# Altium project LEDcontroller_V0.PrjPcb
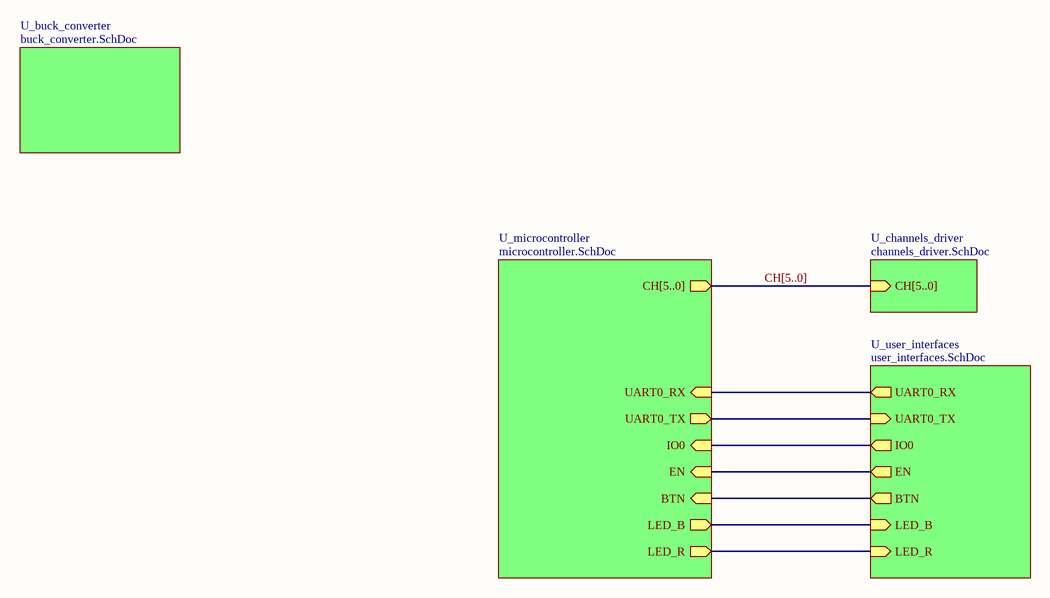
[diagram p0: LEDcontroller.SchDoc]
5 sheets, 40 parts. Net scope: hierarchical (ports join the sheet entries above them; power ports are global).
Board file: LEDcontroller.PcbDoc
Sheets:
  LEDcontroller.SchDoc
    U_buck_converter = buck_converter.SchDoc
    U_microcontroller = microcontroller.SchDoc
    U_channels_driver = channels_driver.SchDoc
    U_user_interfaces = user_interfaces.SchDoc

## Sheet LEDcontroller.SchDoc
size A4; SheetNumber: 1; SheetTotal: 5

### Sub-sheets
U_buck_converter = buck_converter.SchDoc: no entries
U_channels_driver = channels_driver.SchDoc: CH[5..0] (in)
U_microcontroller = microcontroller.SchDoc: CH[5..0] (out), UART0_TX (out), UART0_RX (in), IO0 (in), BTN (in), LED_R (out), LED_B (out), EN (in)
U_user_interfaces = user_interfaces.SchDoc: UART0_TX (in), UART0_RX (out), IO0 (out), EN (out), BTN (out), LED_R (in), LED_B (in)

### Nets
EN: sheet U_microcontroller/EN, sheet U_user_interfaces/EN
IO0: sheet U_microcontroller/IO0, sheet U_user_interfaces/IO0
RX: sheet U_microcontroller/UART0_RX, sheet U_user_interfaces/UART0_RX
TX: sheet U_microcontroller/UART0_TX, sheet U_user_interfaces/UART0_TX
NetD1_1: sheet U_microcontroller/BTN, sheet U_user_interfaces/BTN
NetR11_1: sheet U_microcontroller/LED_B, sheet U_user_interfaces/LED_B
NetR12_1: sheet U_microcontroller/LED_R, sheet U_user_interfaces/LED_R

### Buses and harness runs
bus CH[5..0] = sheet U_channels_driver/CH[5..0] = sheet U_microcontroller/CH[5..0]

## Sheet buck_converter.SchDoc
size A4; SheetNumber: 2; SheetTotal: 5
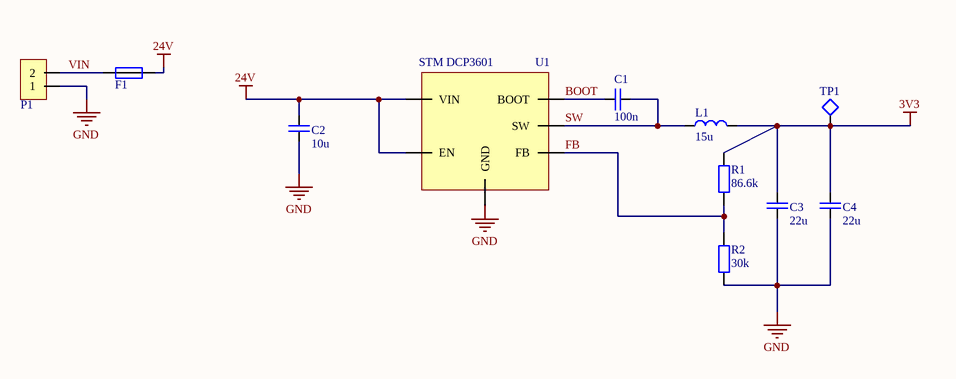
[diagram p1: buck_converter.SchDoc]

### Parts
C1  100n  [capacitor_smd_0603]
C2  10u  [capacitor_smd_1206]
C3  22u  [capacitor_smd_0805]
C4  22u  [capacitor_smd_0805]
F1  Fuse  [resisitor_smd_0603]  (value not drawn)
L1  15u  [inductor_smd_5mm8_x_5mm8]
P1  Terminal Block  [terminal_block_1X2_5mm08]  (value not drawn)
R1  86.6k  [resisitor_smd_0603]
R2  30k  [resisitor_smd_0603]
TP1  Test point  [test_point]  (value not drawn)
U1  STM DCP3601  [generic_sot23-6L]

### Nets
3V3: C3.1 C4.1 L1.2 R1.2 TP1.1
24V: C2.2 F1.1 U1.4(EN) U1.5(VIN)
GND: C2.1 C3.2 C4.2 P1.1 R2.2 U1.2(GND)
BOOT: C1.2 U1.1(BOOT)
FB: R1.1 R2.1 U1.3(FB)
SW: C1.1 L1.1 U1.6(SW)
VIN: F1.2 P1.2

### Library data of the parts
C1 = Capacitor - non-polarised: Vishay GA0603Y104KXAAC31G
C2 = Capacitor - non-polarised: Samsung CL31B106KBHNNNE
C3 C4 = Capacitor - non-polarised: TDK C2012X5R1V226M125AC
F1 = Fuse: Bourns SF-0603HI800M-2
L1 = Inductor: Bourns SRR5828A-150M
P1 = Terminal Block 1X2: Adam Tech EBAFA-02-D
R1 = Resistor: Panasonic ERA-3AEB8662V
R2 = Resistor: Panasonic ERA-3APB303V
U1 = STM DCP3601: STM DCP3601NDMR

## Sheet microcontroller.SchDoc
size A4; SheetNumber: 3; SheetTotal: 5
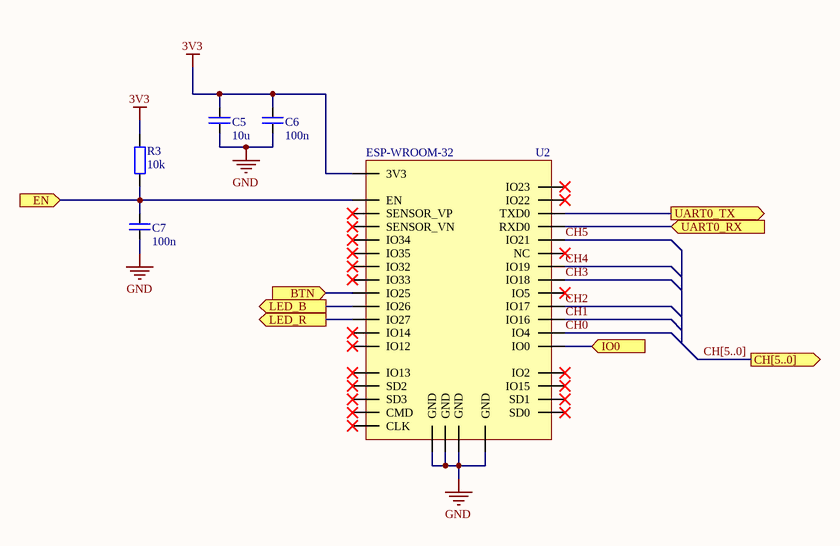
[diagram p2: microcontroller.SchDoc]

### Parts
C5  10u  [capacitor_smd_0805]
C6  100n  [capacitor_smd_0603]
C7  100n  [capacitor_smd_0603]
R3  10k  [resisitor_smd_0603]
U2  ESP-WROOM-32  [ESP-WROOM-32_no_silk]

### Ports
BTN (in, see LEDcontroller[3C], user_interfaces[4C]), CH[5..0] (out, see LEDcontroller[3B], channels_driver[1A]), EN (in, see LEDcontroller[3C], user_interfaces[1A]), IO0 (in, see LEDcontroller[3C], user_interfaces[1A]), LED_B (out, see LEDcontroller[3C], user_interfaces[2C]), LED_R (out, see LEDcontroller[3C], user_interfaces[2C]), UART0_RX (in, see LEDcontroller[3B], user_interfaces[1A]), UART0_TX (out, see LEDcontroller[3B], user_interfaces[1A])

### Nets
3V3: C5.1 C6.1 R3.1 U2.2(3V3)
GND: C5.2 C6.2 C7.2 U2.1(GND) U2.15(GND) U2.38(GND) U2.39(GND)
CH0: U2.26(IO4)
CH1: U2.27(IO16)
CH2: U2.28(IO17)
CH3: U2.30(IO18)
CH4: U2.31(IO19)
CH5: U2.33(IO21)
EN: C7.1 R3.2 U2.3(EN) ; port EN
IO0: U2.25(IO0) ; port IO0
RX: U2.34(RXD0) ; port UART0_RX
TX: U2.35(TXD0) ; port UART0_TX
NetD1_1: U2.10(IO25) ; port BTN
NetR11_1: U2.11(IO26) ; port LED_B
NetR12_1: U2.12(IO27) ; port LED_R

Not connected (* = marked no-connect by the designer): U2 4(SENSOR_VP)* 5(SENSOR_VN)* 6(IO34)* 7(IO35)* 8(IO32)* 9(IO33)* 13(IO14)* 14(IO12)* 16(IO13)* 17(SD2)* 18(SD3)* 19(CMD)* 20(CLK)* 21(SD0)* 22(SD1)* 23(IO15)* 24(IO2)* 29(IO5)* 32(NC)* 36(IO22)* 37(IO23)*

### Buses and harness runs
bus CH[5..0] = port CH[5..0]

### Library data of the parts
C5 = Capacitor - non-polarised: TAIYO YUDEN TMK212BBJ106MGHT
C6 C7 = Capacitor - non-polarised: Vishay GA0603Y104KXAAC31G
R3 = Resistor: Vishay CRCW060310K0FKEI
U2 = ESP-WROOM-32: Espressif ESP-WROOM-32

## Sheet channels_driver.SchDoc: 100R
size A4; Date: 100R; ApprovedBy: 100R; CheckedBy: 100R; Author: 100R; CompanyName: 100R; DrawnBy: 100R; Engineer: 100R; Organization: 100R; Address1: 100R; Address2: 100R; Address3: 100R; Address4: 100R; DocumentNumber: 100R; Revision: 100R; SheetNumber: 4; SheetTotal: 5; CurrentTime: 100R; CurrentDate: 100R; Time: 100R; DocumentFullPathAndName: 100R; DocumentName: 100R; ModifiedDate: 100R; Rule: 100R; ImagePath: 100R; ProjectName: 100R; Application_BuildNumber: 100R
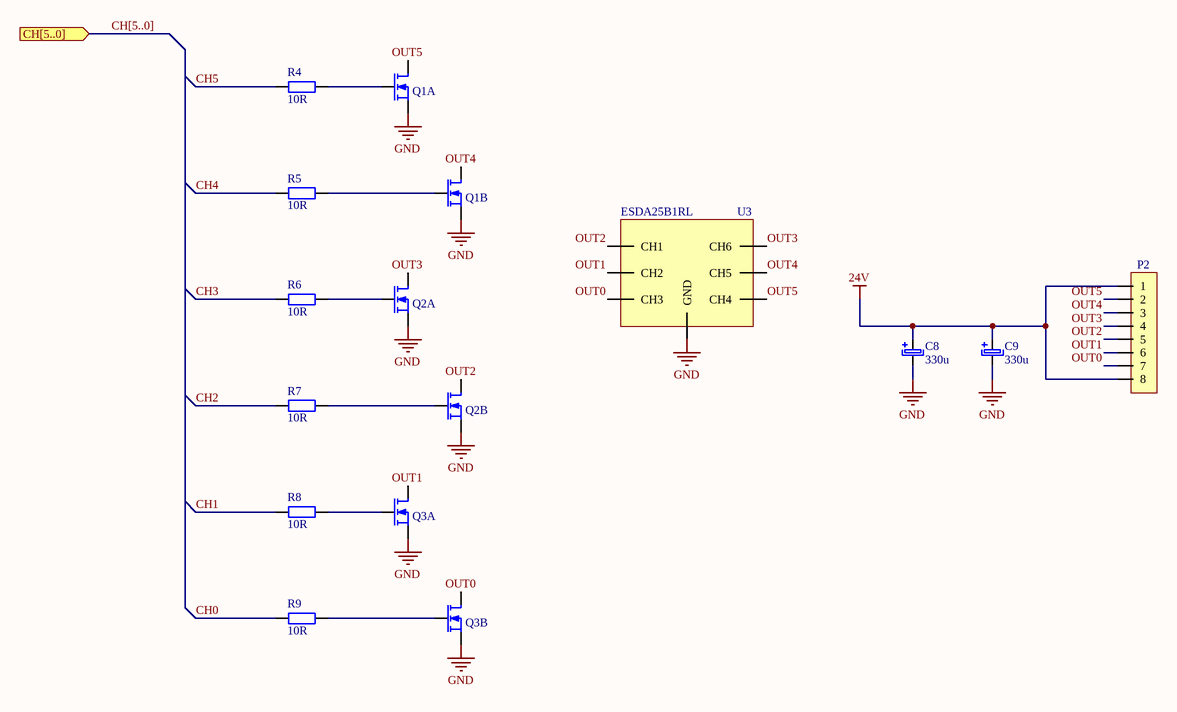
[diagram p3: channels_driver.SchDoc]

### Parts
C8  330u  [capacitor_tht_3mm5_lead_8mm]
C9  330u  [capacitor_tht_3mm5_lead_8mm]
P2  Terminal Block  [terminal_block_1X8_5mm08]  (value not drawn)
Q1  NMOS  [generic_SO-8]  (value not drawn)  (parts A,B of 2)
Q2  NMOS  [generic_SO-8]  (value not drawn)  (parts A,B of 2)
Q3  NMOS  [generic_SO-8]  (value not drawn)  (parts A,B of 2)
R4  10R  [resisitor_smd_0603]
R5  10R  [resisitor_smd_0603]
R6  10R  [resisitor_smd_0603]
R7  10R  [resisitor_smd_0603]
R8  10R  [resisitor_smd_0603]
R9  10R  [resisitor_smd_0603]
U3  ESDA25B1RL  [generic_SO-8]

### Ports
CH[5..0] (in, see LEDcontroller[3B], microcontroller[3C])

### Nets
24V: C8.1 C9.1 P2.1 P2.8
GND: C8.2 C9.2 Q1.2 Q1.5 Q2.2 Q2.5 Q3.2 Q3.5 U3.4,5(GND)
CH0: R9.1
CH1: R8.1
CH2: R7.1
CH3: R6.1
CH4: R5.1
CH5: R4.1
OUT0: P2.7 Q3.6 U3.3(CH3)
OUT1: P2.6 Q3.3 U3.2(CH2)
OUT2: P2.5 Q2.6 U3.1(CH1)
OUT3: P2.4 Q2.3 U3.8(CH6)
OUT4: P2.3 Q1.6 U3.7(CH5)
OUT5: P2.2 Q1.3 U3.6(CH4)
NetQ1_1: Q1.1 R4.2
NetQ1_4: Q1.4 R5.2
NetQ2_1: Q2.1 R6.2
NetQ2_4: Q2.4 R7.2
NetQ3_1: Q3.1 R8.2
NetQ3_4: Q3.4 R9.2

### Buses and harness runs
bus CH[5..0] = port CH[5..0]

### Library data of the parts
C8 C9 = Capacitor - polarised: Panasonic EEU-FS1V331LB
P2 = Terminal Block 1X8: 4x Adam Tech EBAFA-02-D
Q1-Q3 = Transistor - N-MOSFET 2 ch: ONSEMI FDS8949; pin to pad: 1>2 2>1 3>7+8 5>3 6>5+6
R4-R9 = Resistor: Vishay CRCW060310R0FKED
U3 = ESD diodes - 6 channels: STM ESDA25B1RL

## Sheet user_interfaces.SchDoc
size A4; SheetNumber: 5; SheetTotal: 5
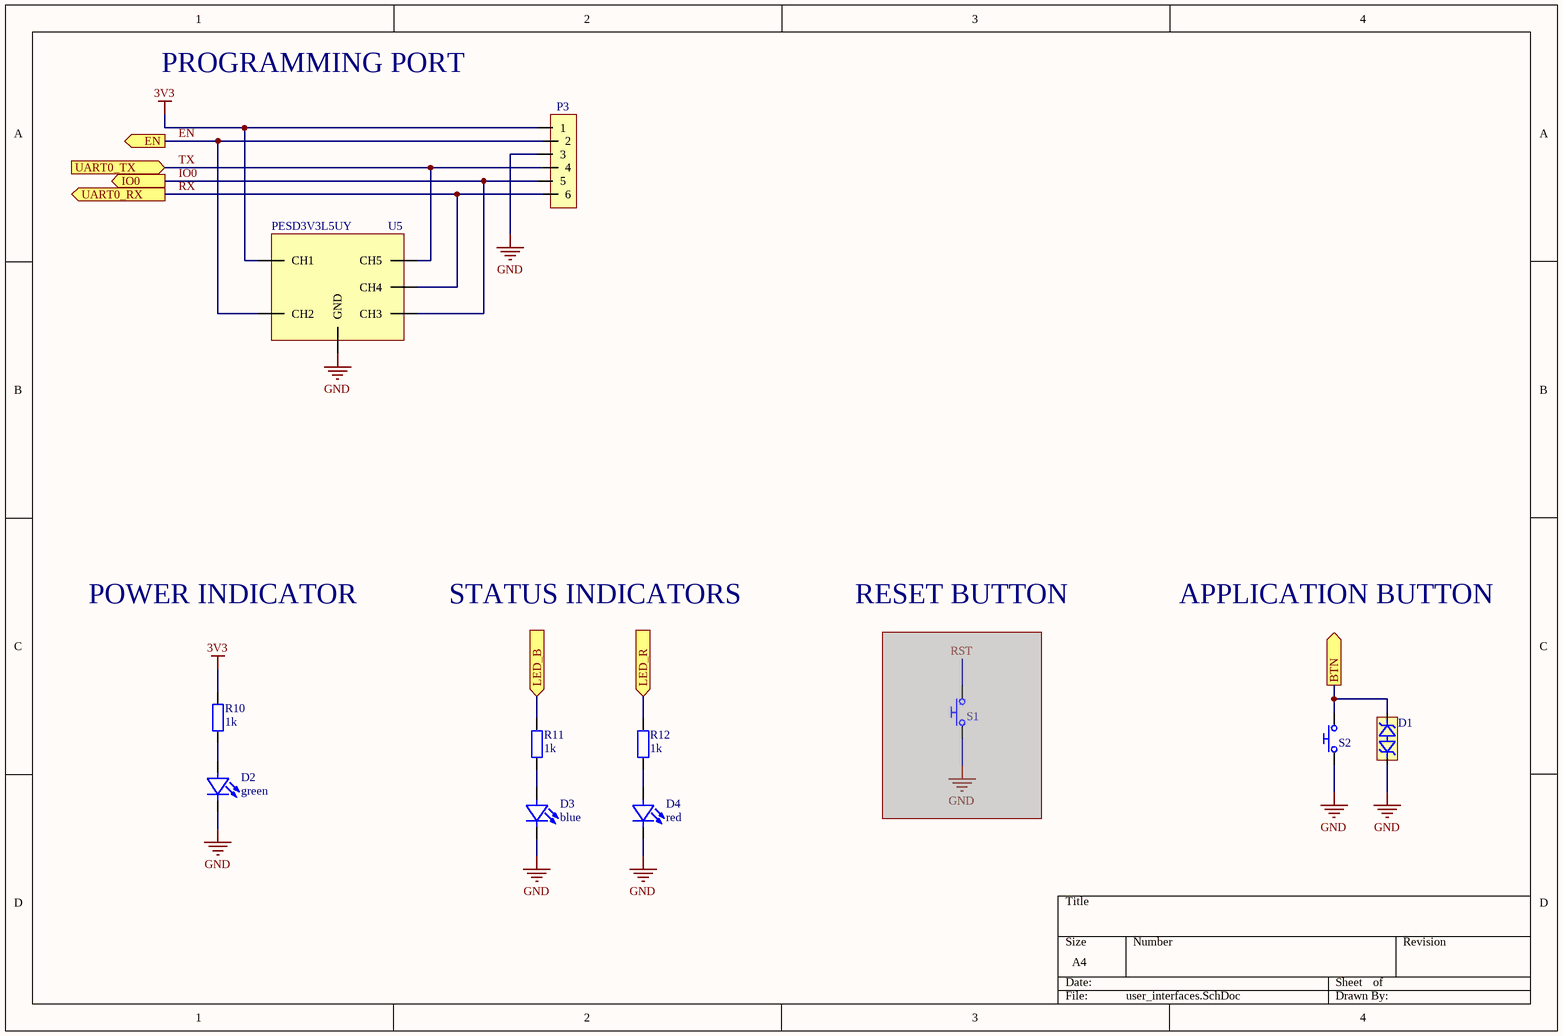
[diagram p4: user_interfaces.SchDoc]

### Parts
D1  CDSOD323-T03SC  [diode_smd_sod_323-2]  (value not drawn)
D2  green  [led_smd_0603]
D3  blue  [led_smd_0603]
D4  red  [led_smd_0603]
P3  Header  [header_2X3_2mm54]  (value not drawn)
R10  1k  [resisitor_smd_0603]
R11  1k  [resisitor_smd_0603]
R12  1k  [resisitor_smd_0603]
S1  value  [tactile_switch_smd_6x6mm_5mm_4_pin]  (value not drawn)  (masked out: inside a compile mask, not in the netlist)
S2  Tactile switch  [tactile_switch_smd_6x6mm_5mm_4_pin]  (value not drawn)
U5  PESD3V3L5UY  [GENERIC_SOT363]

### Ports
BTN (out, see LEDcontroller[3C], microcontroller[2B]), EN (out, see LEDcontroller[3C], microcontroller[1B]), IO0 (out, see LEDcontroller[3C], microcontroller[3B]), LED_B (in, see LEDcontroller[3C], microcontroller[2B]), LED_R (in, see LEDcontroller[3C], microcontroller[2B]), UART0_RX (out, see LEDcontroller[3B], microcontroller[3B]), UART0_TX (in, see LEDcontroller[3B], microcontroller[3B])

### Nets
3V3: P3.1 R10.1 U5.1(CH1)
GND: D1.2 D2.2 D3.2 D4.2 P3.3 S2.1 U5.2(GND)
EN: P3.2 U5.3(CH2) ; port EN
IO0: P3.5 U5.4(CH3) ; port IO0
RX: P3.6 U5.5(CH4) ; port UART0_RX
TX: P3.4 U5.6(CH5) ; port UART0_TX
NetD1_1: D1.1 S2.2 ; port BTN
NetD2_1: D2.1 R10.2
NetD3_1: D3.1 R11.2
NetD4_1: D4.1 R12.2
NetR11_1: R11.1 ; port LED_B
NetR12_1: R12.1 ; port LED_R

### Notes on the sheet
- PROGRAMMING PORT
- POWER INDICATOR
- STATUS INDICATORS
- RESET BUTTON
- APPLICATION BUTTON

### Library data of the parts
D1 = ESD diode: Bourns CDSOD323-T03SC
D2 = LED: Osram KG EELP41.22-PHRH-35-A8J8-20-R18
D3 = LED: ROHM SMLEN3BC8TT86
D4 = LED: Osram KS EELP41.22-P1R2-58-A8J8-020-R18
P3 = Header 2X3
R10-R12 = Resistor: Vishay CRCW06031K00FKED
S1 = Switch - 4 pins V2: pin to pad: 1>1+3 2>2+4
S2 = Switch - 4 pins V2: Same Sky TS04-66-43-BK-160-SMT; pin to pad: 1>1+3 2>2+4
U5 = ESD diodes - 5 channels: Nexperia PESD3V3L5UY,115

## Nets that join several sheets
3V3: buck_converter (5 pins), microcontroller (C5.1 C6.1 R3.1 U2.2), user_interfaces (P3.1 R10.1 U5.1)
24V: buck_converter (C2.2 F1.1 U1.4 U1.5), channels_driver (C8.1 C9.1 P2.1 P2.8)
GND: buck_converter (6 pins), microcontroller (7 pins), channels_driver (9 pins), user_interfaces (7 pins)
CH0: microcontroller (U2.26), channels_driver (R9.1)
CH1: microcontroller (U2.27), channels_driver (R8.1)
CH2: microcontroller (U2.28), channels_driver (R7.1)
CH3: microcontroller (U2.30), channels_driver (R6.1)
CH4: microcontroller (U2.31), channels_driver (R5.1)
CH5: microcontroller (U2.33), channels_driver (R4.1)
EN: microcontroller (C7.1 R3.2 U2.3), user_interfaces (P3.2 U5.3)
IO0: microcontroller (U2.25), user_interfaces (P3.5 U5.4)
NetD1_1: microcontroller (U2.10), user_interfaces (D1.1 S2.2)
NetR11_1: microcontroller (U2.11), user_interfaces (R11.1)
NetR12_1: microcontroller (U2.12), user_interfaces (R12.1)
RX: microcontroller (U2.34), user_interfaces (P3.6 U5.5)
TX: microcontroller (U2.35), user_interfaces (P3.4 U5.6)